# EAGLE design TumTa (EAGLE 8.3.0)
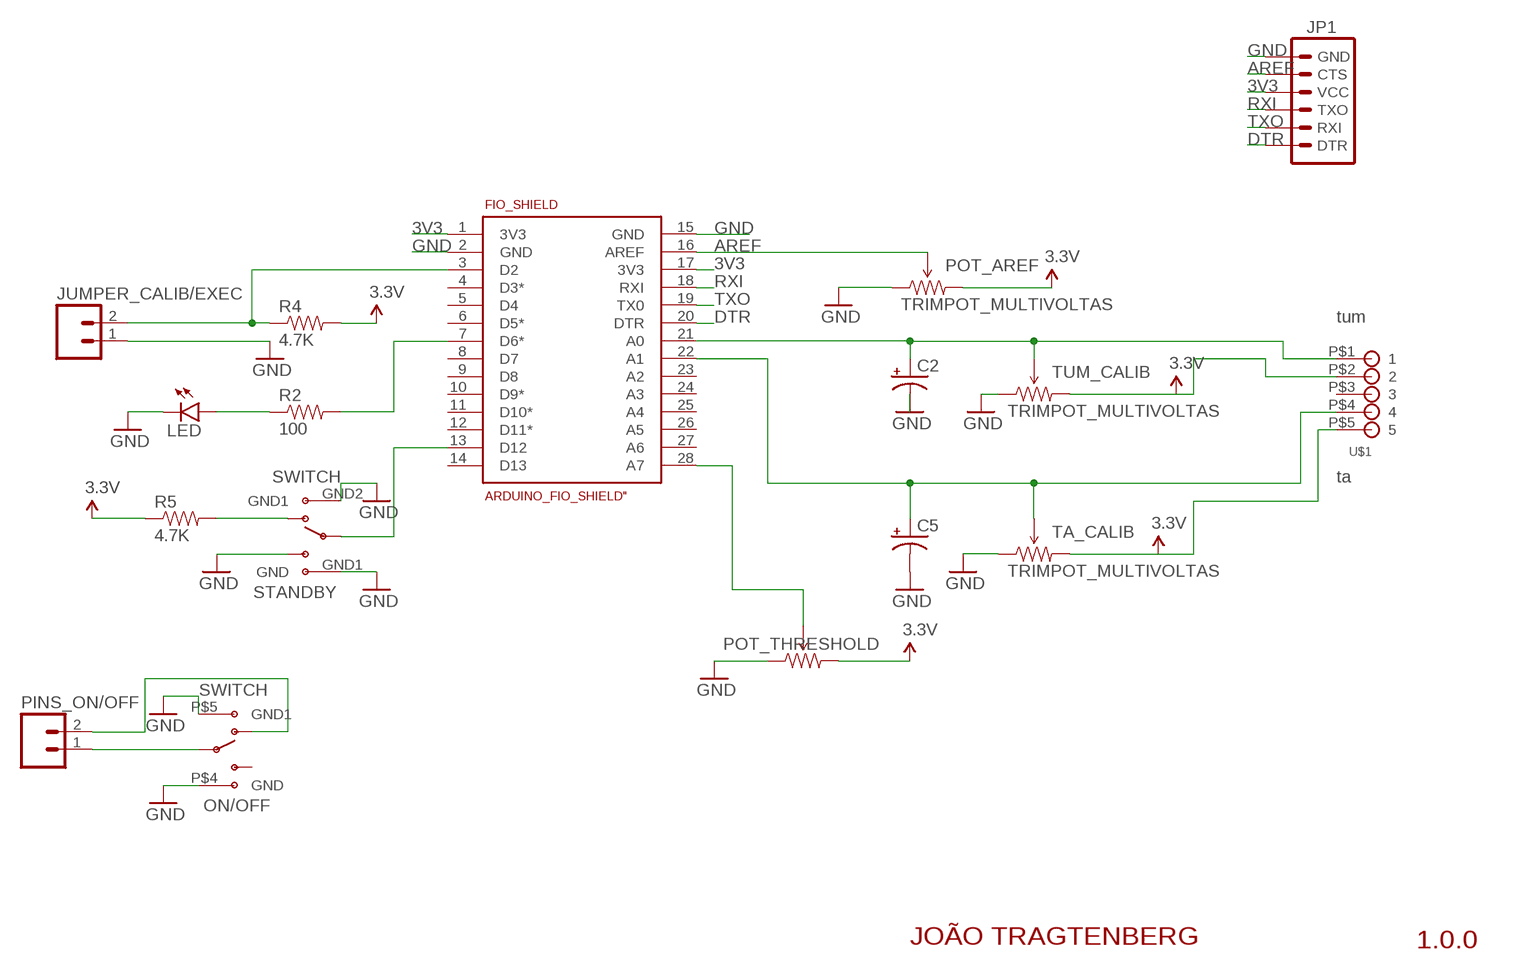
[diagram p0: schematic, sheet 1]

## Parts
C2  CAP_POLPTH2  [CPOL-RADIAL-10UF-25V]
C5  CAP_POLPTH2  [CPOL-RADIAL-10UF-25V]
FIO_SHIELD  ARDUINO_FIO_SHIELD"  [ARDUINO_FIO_SHIELD]
JP1  ARDUINO_SERIAL_PROGRAMPTH  [1X06]
JUMPER_CALIB/EXEC  M02PTH  [1X02]
LED  LED-GREEN5MM_THRU  [LED5MM]
ON/OFF  SWITCH  SWITCH-SPDT-COM-GND3PIN  [SWITCH_HH_2POS_3PIN]
PINS_ON/OFF  M02PTH  [1X02]
POT_AREF  TRIMPOT_MULTIVOLTAS  [TRIMPOT_MULTIVOLTAS]
POT_THRESHOLD  TRIMPOTBR  [TRIM_POT_BR]
R2  100  10OHM-1/10W-1%(0603)SMD  [0603-RES]
R4  4.7K  4.7KOHM-1/10W-1%(0603)  [0603-RES]
R5  4.7K  4.7KOHM-1/10W-1%(0603)  [0603-RES]
STANDBY  SWITCH  SWITCH-SPDT-COM-GND6PIN  [SWITCH_HH_2POS_6PIN]
TA_CALIB  TRIMPOT_MULTIVOLTAS  [TRIMPOT_MULTIVOLTAS]
TUM_CALIB  TRIMPOT_MULTIVOLTAS  [TRIMPOT_MULTIVOLTAS]
U$1  SCREWTERMINAL-5  [SCREWTERMINAL-0.1"-5_BR]

## Nets
3V3: FIO_SHIELD.1(3V3) FIO_SHIELD.17(3V3) JP1.4(VCC) POT_AREF.3(CW) POT_THRESHOLD.3(CW) R4.2 R5.1 TA_CALIB.3(CW) TUM_CALIB.3(CW) U$1.P$2 U$1.P$5 ; supply symbol labelled 3.3V
A0: C2.1(+) FIO_SHIELD.21(A0) TUM_CALIB.2(WIPER) U$1.P$1
A1: C5.1(+) FIO_SHIELD.22(A1) TA_CALIB.2(WIPER) U$1.P$4
AREF: FIO_SHIELD.16(AREF) JP1.5(CTS) POT_AREF.2(WIPER)
D10: FIO_SHIELD.7(D6*) R2.2
DTR: FIO_SHIELD.20(DTR) JP1.1(DTR)
GND: C2.2(-) C5.2(-) FIO_SHIELD.2(GND) FIO_SHIELD.15(GND) JP1.6(GND) JUMPER_CALIB/EXEC.1 LED.K(C) ON/OFF.P$4(GND) ON/OFF.P$5(GND1) POT_AREF.1(CCW) POT_THRESHOLD.1(CCW) STANDBY.GND1(GND) STANDBY.GND2(GND1) STANDBY.P3A(S) TA_CALIB.1(CCW) TUM_CALIB.1(CCW)
N$1: FIO_SHIELD.28(A7) POT_THRESHOLD.2(WIPER)
N$2: FIO_SHIELD.3(D2) JUMPER_CALIB/EXEC.2 R4.1
N$3: FIO_SHIELD.13(D12) STANDBY.P2A(P)
N$4: R5.2 STANDBY.P1A(O)
N$6: ON/OFF.P$1(O) PINS_ON/OFF.2
N$7: LED.A R2.1
N$8: ON/OFF.P$2(P) PINS_ON/OFF.1
RXI: FIO_SHIELD.18(RXI) JP1.3(TXO)
TXO: FIO_SHIELD.19(TX0) JP1.2(RXI)
Unconnected: FIO_SHIELD.4(D3*) FIO_SHIELD.5(D4) FIO_SHIELD.6(D5*) FIO_SHIELD.8(D7) FIO_SHIELD.9(D8) FIO_SHIELD.10(D9*) FIO_SHIELD.11(D10*) FIO_SHIELD.12(D11*) FIO_SHIELD.14(D13) FIO_SHIELD.23(A2) FIO_SHIELD.24(A3) FIO_SHIELD.25(A4) FIO_SHIELD.26(A5) FIO_SHIELD.27(A6) ON/OFF.P$3(S) U$1.P$3

## Notes on the sheet
- tum
- ta
- JOÃO TRAGTENBERG | 1.0.0

## Library data of the parts
C2 C5 = SparkFun-Passives:CAP_POL: Capacitor Polarized These are standard SMD and PTH capacitors. Normally 10uF, 47uF, and 100uF in electrolytic and tantalum varieties. Always verify the external diameter of the through hole cap, it varies with capacity, voltage, and manufacturer. The EIA devices should be standard.
FIO_SHIELD = SparkFun-Boards:ARDUINO_FIO_SHIELD: Arduino FIO Shield this device is intended to develop arduino FIO shields, so that the distance between the headers are the same as the Arduino FIO's.
JP1 = SparkFun-Connectors:ARDUINO_SERIAL_PROGRAM: FTDI connector footprints
JUMPER_CALIB/EXEC PINS_ON/OFF = SparkFun-Connectors:M02: Standard 2-pin 0.1" header. Use with - straight break away headers ( PRT-00116) - right angle break away headers (PRT-00553) - swiss pins (PRT-00743) - machine pins (PRT-00117) - female headers (PRT-00115) Molex polarized connector foot print use with: PRT-08233 with associated crimp pins and housings. 2.54_SCREWTERM for use with PRT-10571. 3.5mm Screw Terminal footprints for PRT-08084 5mm Screw Terminal footprints for use with PRT-08432
LED = SparkFun-LED:LED-GREEN: Various green LEDs Green LEDs used in SFE Production 0603- DIO-00821 LARGE- DIO-00862 LILYPAD- DIO-09910 5MM Through Hole
ON/OFF STANDBY = SparkFun-Electromechanical:SWITCH-SPDT-COM-GND
POT_AREF TA_CALIB TUM_CALIB = SparkFun-Electromechanical:TRIMPOT_MULTIVOLTAS: Trimpot multivoltas (untested)
POT_THRESHOLD = SparkFun-Electromechanical:TRIMPOT: Various small potentiometers for "set-and-forget" applications
R2 = SparkFun-Resistors:10OHM-1/10W-1%(0603): RES-12581; PROD_ID: RES-12581; VALUE: 10
R4 R5 = SparkFun-Resistors:4.7KOHM-1/10W-1%(0603): RES-07857; PROD_ID: RES-07857
U$1 = SparkFun-Connectors:SCREWTERMINAL-5

## Net classes
0 default: width 0.813 mm, drill 0.813 mm, clearance 0.813 mm

## Board
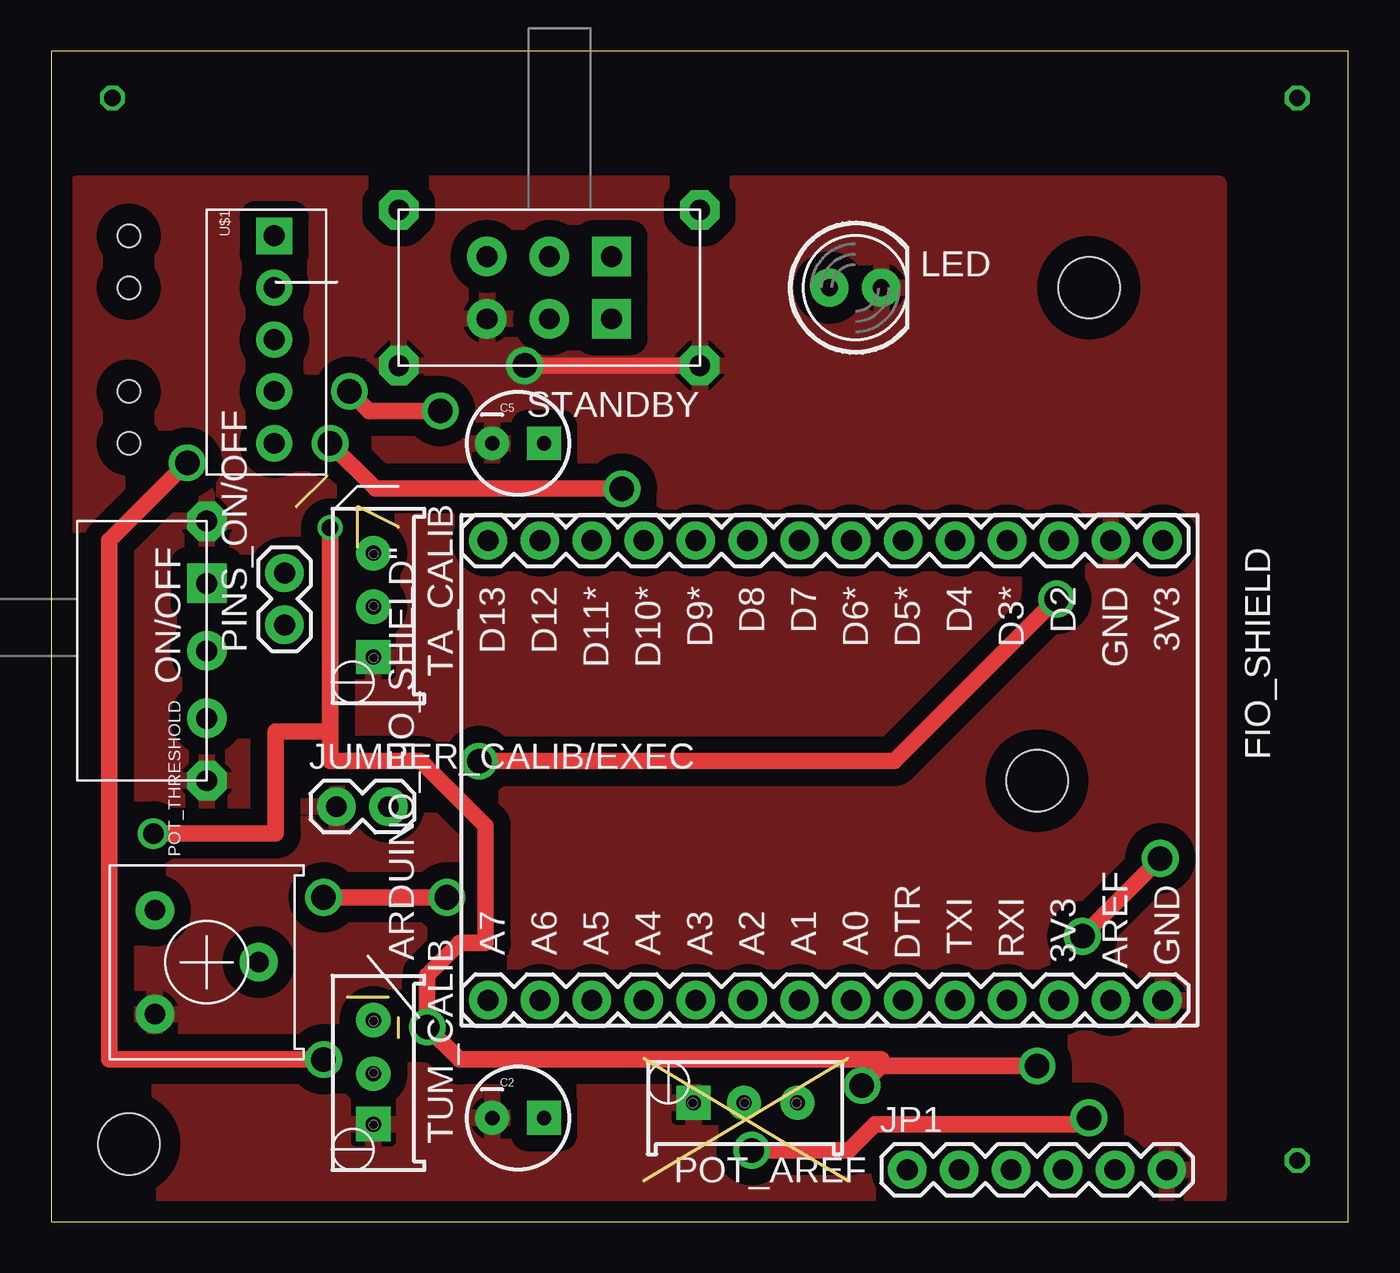
[diagram p1: board, top side]
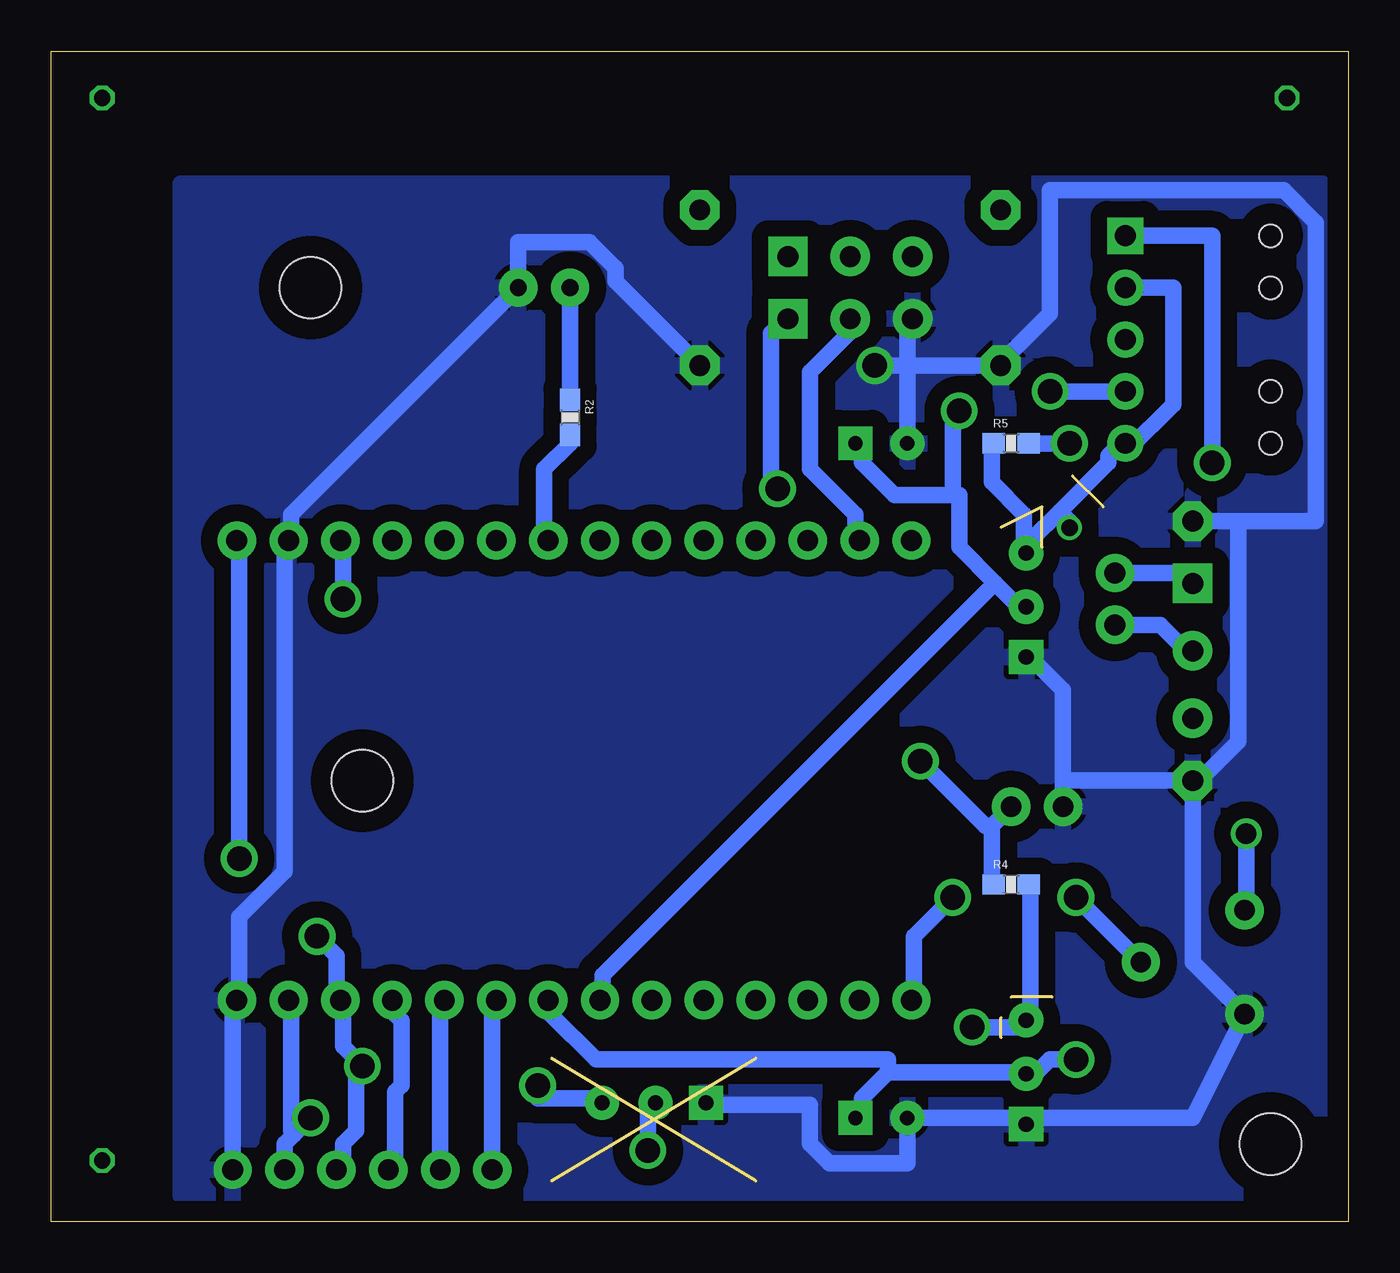
[diagram p2: board, bottom side, seen from below]

Size 63.5 x 57.3 mm. Coordinates in mm from the lower left corner, seen from the top.
Outline: 0,0 63.5,0 63.5,57.3 0,57.3 0,0
Copper layers (1*16): Top 0.035mm / dielectric 1.5mm / Bottom 0.035mm
Design rules "default": minimum track width 10mil, minimum drill 24mil, track to track 8mil, track to pad 8mil, pad to pad 8mil, via to via 8mil, smd to smd 8mil, copper to edge 40mil, drill to drill 8mil, minimum pad ring 10mil, minimum via ring 8mil, stop-mask expansion 4mil, vias tented up to drill 0mil, thermal gap 10mil
Holes 1.1 mm at 3.81,48.26 3.81,45.72 3.81,38.1 3.81,40.64
Holes 3 mm at 50.8,45.72 48.26,21.59 3.81,3.81
Milling: 7 lines

### Footprints (pad centres in the part's own frame; a part is rotated, then mirrored left to right if it is on the bottom)
CPOL-RADIAL-10UF-25V = drill 0.7 pad 1.651 square: 1 1.27,0 | drill 0.7 pad 1.651: 2 -1.27,0
ARDUINO_FIO_SHIELD = drill 1.016 pad 1.88: 1 -11.75,15.04; 2 -11.75,12.5; 3 -11.75,9.96; 4 -11.75,7.42; 5 -11.75,4.88; 6 -11.75,2.34; 7 -11.75,-0.2; 8 -11.75,-2.74; 9 -11.75,-5.28; 10 -11.75,-7.82; 11 -11.75,-10.36; 12 -11.75,-12.9; 13 -11.75,-15.44; 14 -11.75,-17.98; 15 10.75,15.04; 16 10.75,12.5; 17 10.75,9.96; 18 10.75,7.42; 19 10.75,4.88; 20 10.75,2.34; 21 10.75,-0.2; 22 10.75,-2.74; 23 10.75,-5.28; 24 10.75,-7.82; 25 10.75,-10.36; 26 10.75,-12.9; 27 10.75,-15.44; 28 10.75,-17.98
1X06 = drill 1.016 pad 1.88: 1 0,0; 2 2.54,0; 3 5.08,0; 4 7.62,0; 5 10.16,0; 6 12.7,0
1X02 = drill 1.016 pad 1.88: 1 0,0; 2 2.54,0
LED5MM = drill 0.813 pad 1.88: A -1.27,0; K 1.27,0
SWITCH_HH_2POS_3PIN = drill 1.016 pad 1.93 square: P$1 3.048,6.35 | drill 1.016 pad 1.93: P$2 6.35,6.35; P$3 9.652,6.35 | drill 1.016 pad 1.93 octagon: P$4 0,6.35; P$5 12.7,6.35
TRIMPOT_MULTIVOLTAS = drill 0.737 pad 1.676 square: 1 2.238,2.005 | drill 0.737 pad 1.676: 2 4.7,2.005; 3 7.322,2.005
TRIM_POT_BR = drill 1 pad 1.88: 1 -2.54,2.54; 2 0,-2.54; 3 2.54,2.54
0603-RES = smd 1.1 x 1: 1 -0.85,0; 2 0.85,0
SWITCH_HH_2POS_6PIN = drill 1.016 pad 1.93 octagon: GND1 0,7.62; GND2 14.732,7.62; GND3 0,0; GND4 14.732,0 | drill 1.016 pad 1.93 square: P1A 4.318,5.334; P1B 4.318,2.286 | drill 1.016 pad 1.93: P2A 7.366,5.334; P2B 7.366,2.286; P3A 10.414,5.334; P3B 10.414,2.286
SCREWTERMINAL-0.1"-5_BR = drill 1.016 pad 1.778 square: P$1 1.27,3.302 | drill 1.016 pad 1.778: P$2 3.81,3.302; P$3 6.35,3.302; P$4 8.89,3.302; P$5 11.43,3.302

### Placement (x,y rotation side)
C2  22.86,5.08 0 top
C5  22.86,38.1 0 top
FIO_SHIELD  39.37,21.59 270 top
JP1  41.91,2.54 0 top
JUMPER_CALIB/EXEC  13.97,20.32 0 top
LED  39.37,45.72 0 top
ON/OFF  1.27,34.29 270 top
PINS_ON/OFF  11.43,29.21 90 top
POT_AREF  29.21,3.81 0 top
POT_THRESHOLD  7.62,12.7 90 top
R2  38.1,39.37 270 bottom
R4  16.51,16.51 0 bottom
R5  16.51,38.1 0 bottom
STANDBY  31.75,49.53 180 top
TA_CALIB  17.78,25.4 90 top
TUM_CALIB  17.78,2.54 90 top
U$1  7.62,49.53 270 top

### Tracks (layer width: path | path; a pad name or v marks a point on that pad's centre or on a via)
3V3  (via drill 0.81, 1, 1.2)
  Top 0.813: 40.64,7.62 v39.69,6.67 | v48.26,7.62 40.64,7.62 | v50.48,13.97 v54.29,17.78 | 40.64,7.62 40.64,7.94 20,7.94 v18.41,9.53 18.41,12.06 20,13.65 21.27,13.65 21.27,19.37 18.1,22.54 13.65,22.54 13.65,24 | 13.65,24 v13.65,33.97 | v5,19 11,19 11,24 13.65,24
  Bottom 0.813: R5.1 17.46,38.1 17.46,36.2 15.88,34.61 15.88,33.02 TA_CALIB.3 15.56,33.34 14.13,34.77 | 14.13,34.77 11.75,37.15 11.75,37.47 11.11,38.1 U$1.P$5 10.79,37.78 8.57,40.01 8.57,45.72 U$1.P$2 | R4.2 15.56,16.51 15.56,10.16 TUM_CALIB.3 15.88,9.53 v18.41,9.53 | v39.69,6.67 39.69,6.03 36.83,6.03 POT_AREF.3 | JP1.4 49.21,2.86 49.21,3.81 48.58,4.45 48.58,7.62 v48.26,7.62 49.21,8.57 49.21,10.79 FIO_SHIELD.17 49.53,11.11 49.53,13.02 v50.48,13.97 | v54.29,17.78 54.29,33.34 FIO_SHIELD.1 | 14.13,34.77 13.65,34.29 v13.65,33.97 | POT_THRESHOLD.3 5,15.24 v5,19
A0  (via drill 1.2)
  Top 0.813: v6.67,37.15 2.86,33.34 2.86,7.94 v13.34,7.94
  Bottom 0.813: C2.1 23.81,5.4 23.81,6.03 22.54,7.3 | 22.54,7.3 15.88,7.3 TUM_CALIB.2 15.56,6.99 14.61,7.94 v13.34,7.94 | U$1.P$1 6.67,48.26 v6.67,37.15 | FIO_SHIELD.21 39.05,10.79 39.05,10.16 36.83,7.94 22.54,7.94 22.54,7.3
A1  (via drill 1.2)
  Top 0.813: v14.61,40.64 15.56,39.69 v19.05,39.69
  Bottom 0.813: C5.1 23.81,37.78 23.81,37.15 22.23,35.56 19.37,35.56 | 19.37,35.56 19.05,35.56 19.05,33.02 17.3,31.27 | 17.3,31.27 15.88,29.84 TA_CALIB.2 | v14.61,40.64 U$1.P$4 | v19.05,39.69 19.37,39.37 19.37,35.56 | 17.3,31.27 36.51,12.06 36.51,11.11 FIO_SHIELD.22
AREF  (via drill 1.2)
  Top 0.813: v34.29,3.49 39.05,3.49 40.32,4.76 50.48,4.76 v50.8,5.08
  Bottom 0.813: v34.29,3.49 34.29,5.4 33.97,5.71 POT_AREF.2 | 51.59,4.29 52.07,3.81 JP1.5 | 51.59,4.29 v50.8,5.08 | FIO_SHIELD.16 51.75,10.79 51.75,4.45 51.59,4.29
D10
  Bottom 0.813: FIO_SHIELD.7 39.37,33.54 39.37,36.83 38.1,38.1 R2.2
DTR
  Bottom 0.813: JP1.1 41.91,10.79 FIO_SHIELD.20
GND  (via drill 1.2)
  Top 0.813: STANDBY.GND1 v23.18,41.91
  Bottom 0.813: POT_AREF.1 31.43,5.71 26.35,5.71 26.35,3.81 25.4,2.86 21.59,2.86 C2.2 15.88,5.08 TUM_CALIB.1 15.56,5.08 7.62,5.08 POT_THRESHOLD.1 7.62,12.7 ON/OFF.P$5 | JUMPER_CALIB/EXEC.1 13.97,21.59 | 13.97,21.59 13.97,26.04 15.56,27.62 TA_CALIB.1 | 5.4,34.29 ON/OFF.P$4 | 5.4,34.29 5.4,23.5 7.3,21.59 ON/OFF.P$5 | ON/OFF.P$5 13.97,21.59 | 21.59,41.91 21.59,44.13 STANDBY.P3A | 21.59,41.91 C5.2 | 21.59,41.91 STANDBY.GND2 16.83,42.23 14.61,44.45 14.61,50.48 3.17,50.48 1.59,48.9 1.59,34.29 5.4,34.29 | JP1.6 54.61,10.79 FIO_SHIELD.15 54.29,11.11 54.29,14.92 52.07,17.14 52.07,33.02 FIO_SHIELD.2 51.75,33.66 51.75,34.61 LED.K 40.64,47.94 37.15,47.94 35.88,46.67 35.88,46.04 STANDBY.GND1 | v23.18,41.91 21.59,41.91
  pour Top: 1.27,50.8 57.15,50.8 57.15,1.27 1.27,1.27
  pour Bottom: 1.27,1.27 1.27,50.8 57.15,50.8 57.15,1.27
N$1  (via drill 1.2)
  Top 0.813: v19.37,15.88 v13.34,15.88
  Bottom 0.813: v13.34,15.88 POT_THRESHOLD.2 | v19.37,15.88 21.27,13.97 21.27,11.11 FIO_SHIELD.28
N$2  (via drill 1.2)
  Top 0.813: v49.21,30.48 41.27,22.54 v20.95,22.54
  Bottom 0.813: 17.46,19.37 17.46,16.51 R4.1 | JUMPER_CALIB/EXEC.2 17.46,19.37 | v49.21,30.48 49.21,33.34 FIO_SHIELD.3 | v20.95,22.54 17.78,19.37 17.46,19.37
N$3
  Bottom 0.813: FIO_SHIELD.13 24.13,33.66 24.13,34.61 26.35,36.83 26.35,41.59 24.45,43.5 24.45,44.13 STANDBY.P2A
N$4  (via drill 1.2)
  Top 0.813: v13.65,38.1 15.88,35.88 v27.94,35.88
  Bottom 0.813: v13.65,38.1 R5.2 | v27.94,35.88 28.26,36.2 28.26,43.5 27.62,44.13 STANDBY.P1A
N$5  (via drill 0.8)
  other vias: 3,55
N$6
  Bottom 0.813: PINS_ON/OFF.2 7.62,31.75 ON/OFF.P$1
N$7
  Bottom 0.813: LED.A R2.1
N$8
  Bottom 0.813: PINS_ON/OFF.1 9.21,29.21 7.94,27.94 ON/OFF.P$2
N$9  (via drill 0.8)
  other vias: 61,55
N$10  (via drill 0.8)
  other vias: 61,3
RXI
  Bottom 0.813: JP1.3 46.67,2.86 46.67,6.35 46.35,6.67 46.35,9.84 46.67,10.16 46.67,10.79 FIO_SHIELD.18
TXO
  Bottom 0.813: JP1.2 44.45,10.79 FIO_SHIELD.19